# Altium schematic sheet Circuit.SchDoc
size 431 x 279 mm; SheetNumber: 5; SheetTotal: 5; ENG_APP_DATE: --/--/--; DSN_APP_DATE: --/--/--; CHK_APP_DATE: --/--/--
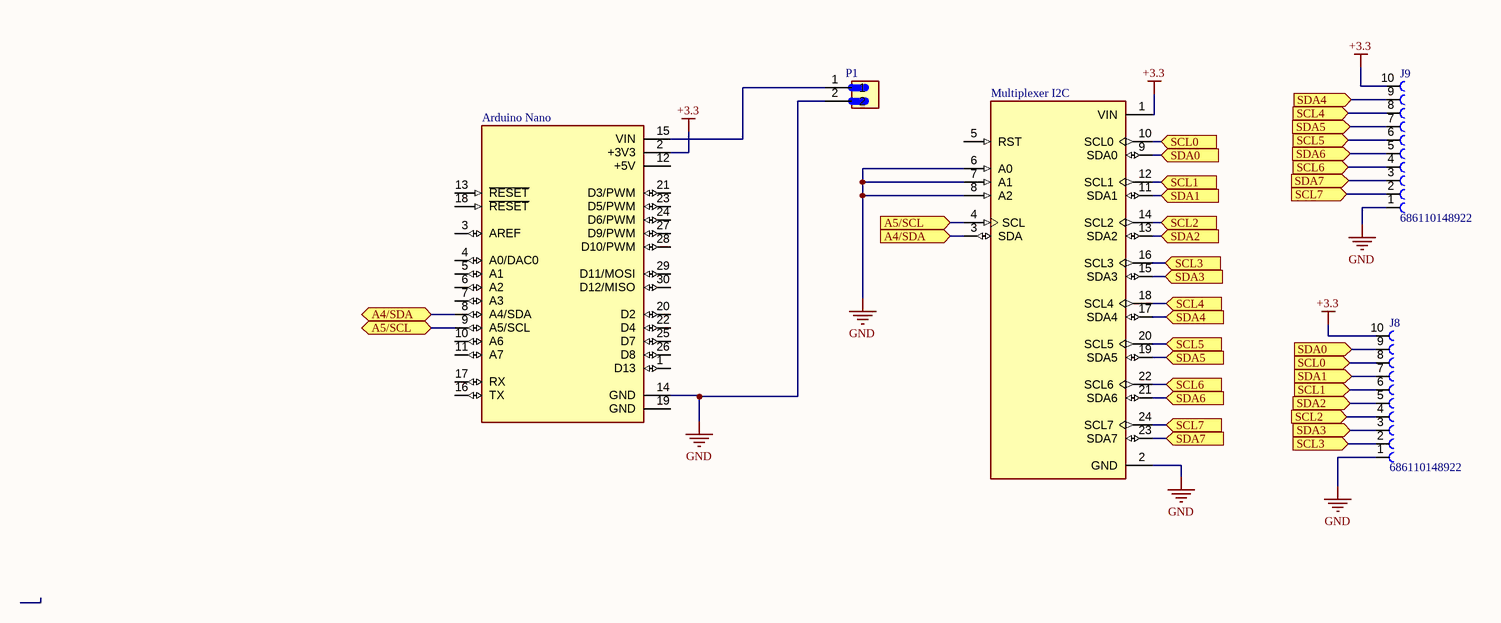
[diagram p0: Circuit.SchDoc]

## Parts
Arduino_Nano  ABX00028  [MODULE_ABX00028]  (value not drawn)
J8  686110148922  [686110148922]
J9  686110148922  [686110148922]
Multiplexer_I2C  2717  [MODULE_2717]  (value not drawn)
P1  S2B-XH-A(LF)(SN)  [JST_S2B-XH-A(LF)(SN)]  (value not drawn)

## Ports
A4/SDA (bidir), A4/SDA (in), A5/SCL (bidir), A5/SCL (in), SCL0 (in), SCL1 (in), SCL2 (in), SCL3 (in), SCL4 (in), SCL5 (in), SCL6 (in), SCL7 (in), SDA0 (in), SDA1 (in), SDA2 (in), SDA3 (in), SDA4 (in), SDA5 (in), SDA6 (in), SDA7 (in)

## Nets
+3.3: Arduino_Nano.2(+3V3) J8.10 J9.10 Multiplexer_I2C.1(VIN)
GND: Arduino_Nano.14(GND) J8.1 J9.1 Multiplexer_I2C.2(GND) Multiplexer_I2C.6(A0) Multiplexer_I2C.7(A1) Multiplexer_I2C.8(A2) P1.2
A4/SDA: Arduino_Nano.8(A4/SDA) Multiplexer_I2C.3(SDA) ; port A4/SDA
A5/SCL: Arduino_Nano.9(A5/SCL) Multiplexer_I2C.4(SCL) ; port A5/SCL
SCL0: J8.8 Multiplexer_I2C.10(SCL0) ; port SCL0
SCL1: J8.6 Multiplexer_I2C.12(SCL1) ; port SCL1
SCL2: J8.4 Multiplexer_I2C.14(SCL2) ; port SCL2
SCL3: J8.2 Multiplexer_I2C.16(SCL3) ; port SCL3
SCL4: J9.8 Multiplexer_I2C.18(SCL4) ; port SCL4
SCL5: J9.6 Multiplexer_I2C.20(SCL5) ; port SCL5
SCL6: J9.4 Multiplexer_I2C.22(SCL6) ; port SCL6
SCL7: J9.2 Multiplexer_I2C.24(SCL7) ; port SCL7
SDA0: J8.9 Multiplexer_I2C.9(SDA0) ; port SDA0
SDA1: J8.7 Multiplexer_I2C.11(SDA1) ; port SDA1
SDA2: J8.5 Multiplexer_I2C.13(SDA2) ; port SDA2
SDA3: J8.3 Multiplexer_I2C.15(SDA3) ; port SDA3
SDA4: J9.9 Multiplexer_I2C.17(SDA4) ; port SDA4
SDA5: J9.7 Multiplexer_I2C.19(SDA5) ; port SDA5
SDA6: J9.5 Multiplexer_I2C.21(SDA6) ; port SDA6
SDA7: J9.3 Multiplexer_I2C.23(SDA7) ; port SDA7
NetArduino_Nano_15: Arduino_Nano.15(VIN) P1.1

Not connected (* = marked no-connect by the designer): Arduino_Nano 1(D13) 3(AREF) 4(A0/DAC0) 5(A1) 6(A2) 7(A3) 10(A6) 11(A7) 12(+5V) 13(~{RESET}) 16(TX) 17(RX) 18(~{RESET}) 19(GND) 20(D2) 21(D3/PWM) 22(D4) 23(D5/PWM) 24(D6/PWM) 25(D7) 26(D8) 27(D9/PWM) 28(D10/PWM) 29(D11/MOSI) 30(D12/MISO); Multiplexer_I2C 5(RST)

## Notes on the sheet
- DWG. NO.
- REV.
- SHT.
- THIS DOCUMENT AND THE DATA DISCLOSED HEREIN OR HEREWITH IS THE PROPERTY OF ALTIUM LIMITED AND MAY BE FREELY DISTRIBUTED IN WHOLE. NO RIGHTS ARE RESERVED OR EXPRESS OR IMPLIED WARANTEE GIVEN.
- REVISION
- DESCRIPTION
- DATE
- APPROVED
- ENG:
- APPROVALS
- PROJECT
- DSN:
- CHK:
- REFERENCE DOCUMENTS
- PROJECT REVISION:
- TITLE
- DOCUMENT REVISION:
- DESIGN ITEM:
- BOM:
- FAB DWG:
- PCB DWG:
- ASSY DWG:
- SCALE:
- SIZE
- B
- CAGE CODE
- FILE NAME
- DWG NO.
- SHEET
- OF
- REV

## Library data of the parts
Arduino_Nano = ABX00028: Arduinoâ€™s 5V compatible board in the smallest available form factor: 45x18mm!; MP: Arduino Nano Every; Check_prices: https://www.snapeda.com/parts/Arduino%20Nano%20Every/Arduino/view-part/?ref=eda; Value: *; Availability: Not in stock; Price: None; Package: None; SnapEDA_Link: https://www.snapeda.com/parts/Arduino%20Nano%20Every/Arduino/view-part/?ref=snap; MF: Arduino
J8 J9 = 686110148922: 10 Position FFC, FPC Connector Contacts, Bottom 0.039 (1.00mm) Surface Mount, Right Angle; MF: Wurth Elektronik; Check_prices: https://www.snapeda.com/parts/686110148922/Wurth+Elektronik/view-part/?ref=eda; Price: None; Purchase-URL: https://pricing.snapeda.com/search/part/686110148922/?ref=eda; Availability: In Stock; SnapEDA_Link: https://www.snapeda.com/parts/686110148922/Wurth+Elektronik/view-part/?ref=snap; Package: None; MP: 686110148922; Value: *
Multiplexer_I2C = 2717: Module: multiplexer; I2C interface multiplexer; TCA9548A; 3Ã·5VDC; MF: Adafruit; SnapEDA_Link: https://www.snapeda.com/parts/2717/Adafruit+Industries+LLC/view-part/?ref=snap; Availability: In Stock; Purchase-URL: https://pricing.snapeda.com/search/part/2717/?ref=eda; Check_prices: https://www.snapeda.com/parts/2717/Adafruit+Industries+LLC/view-part/?ref=eda; Value: *; Package: None; MP: 2717; Price: None
P1 = S2B-XH-A(LF)(SN): Connector Header Through Hole, Right Angle 2 position 0.098 (2.50mm); MF: JST Sales; Purchase-URL: https://pricing.snapeda.com/search/part/S2B-XH-A(LF)(SN)/?ref=eda; Digi-Key_Part_Number: 455-2257-ND; Package: None; Check_prices: https://www.snapeda.com/parts/S2B-XH-A(LF)(SN)/JST+Sales+America+Inc./view-part/?ref=eda; Value: *; SnapEDA_Link: https://www.snapeda.com/parts/S2B-XH-A(LF)(SN)/JST+Sales+America+Inc./view-part/?ref=snap; MP: S2B-XH-A(LF)(SN)